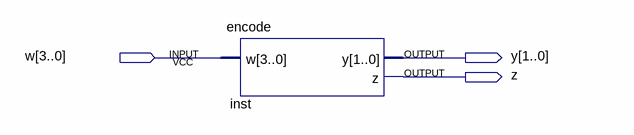
[diagram p0: schematic sheet]
// Quartus schematic EndcodeBDF.bdf as structural Verilog: 1 symbols, 3 pins
module EndcodeBDF (
  input  [3:0] w,
  output [1:0] y,
  output z
);

  encode inst (.w(w), .y(y), .z(z));
endmodule
